# EAGLE schematic plug-v20-Make-board-myself-to-test-circuit (EAGLE 7.6.0)
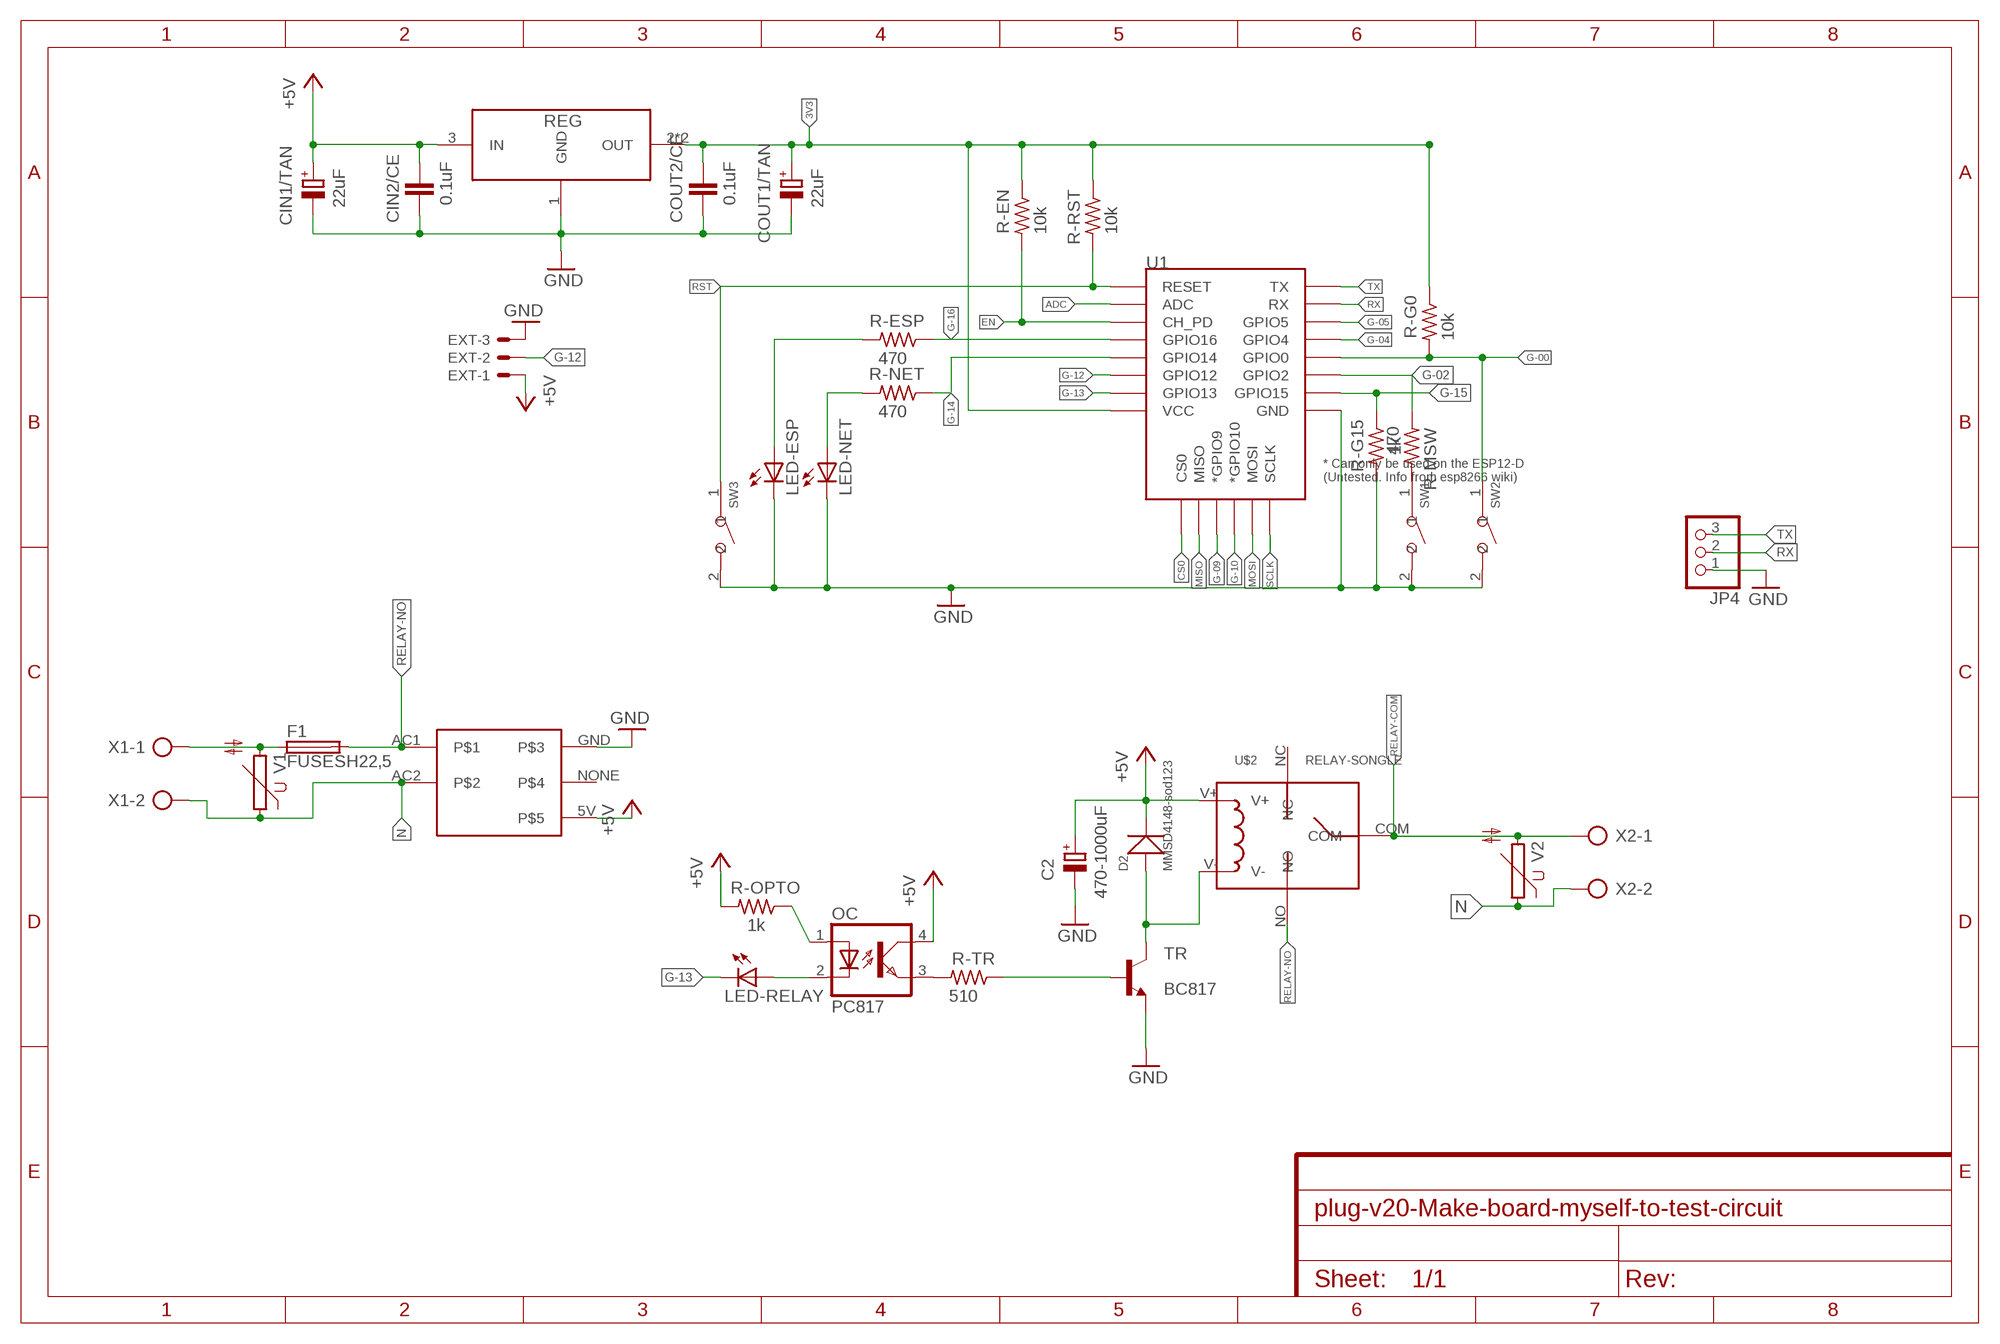
[diagram p0: schematic, sheet 1]

## Parts
C2  470-1000uF  CPOL-EUE3.5-8  [E3,5-8]
CIN1/TAN  22uF  CPOL-EUB/3528-21R  [B/3528-21R]
CIN2/CE  0.1uF  C-EUC0805K  [C0805K]
COUT1/TAN  22uF  CPOL-EUB/3528-21R  [B/3528-21R]
COUT2/CE  0.1uF  C-EUC0805K  [C0805K]
D2  MMSD4148-sod123  SMD-DIODE-100V-200MA(SOD-123)  [SOD-123]
EXT  53048-03  [53048-03]
F1  FUSESH22,5  [SH22,5]
JP4  PINHD-1X3  [1X03]
LED-ESP  LEDCHIPLED_0805  [CHIPLED_0805]
LED-NET  LEDCHIPLED_0805  [CHIPLED_0805]
LED-RELAY  LEDCHIPLED_0805  [CHIPLED_0805]
OC  PC817  [DIL04]
R-EN  10k  R-US_M0805  [M0805]
R-ESP  470  R-US_M0805  [M0805]
R-G0  10k  R-US_M0805  [M0805]
R-G15  1k  R-US_M0805  [M0805]
R-MSW  470  R-US_M0805  [M0805]
R-NET  470  R-US_M0805  [M0805]
R-OPTO  1k  R-US_M0805  [M0805]
R-RST  10k  R-US_M0805  [M0805]
R-TR  510  R-US_M0805  [M0805]
REG  AMS1117-3.3  [SOT-223]
SW1  DIP-BUTTON(2P-6.0X3.0X4.3MM)-TS-1101F  [SW2-5.0-6.0X3.0X4.3MM]
SW2  DIP-BUTTON(2P-6.0X3.0X4.3MM)-TS-1101F  [SW2-5.0-6.0X3.0X4.3MM]
SW3  DIP-BUTTON(2P-6.0X3.0X4.3MM)-TS-1101F  [SW2-5.0-6.0X3.0X4.3MM]
TR  BC817  BC817-16SMD  [SOT23-BEC]
U1  ESP12ESMD  [ESP12E-SMD]
U$2  RELAY-SONGLE  [RELAY-SONGLE]
U$4  POWERSUPPLY-5V-700MA  [POWERSUPPLY-5V-700MA]
V1  S14K11  [S14K11]
V2  S14K11  [S14K11]
X1  AK300/2  [AK300/2]
X2  AK300/2  [AK300/2]

## Nets
3V3: COUT1/TAN.+ COUT2/CE.1 R-EN.1 R-G0.1 R-RST.1 REG.2(OUT) REG.4(OUT) U1.VCC
+5V: C2.+ CIN1/TAN.+ CIN2/CE.1 D2.- EXT.1 OC.4(COL) R-OPTO.2 REG.3(IN) U$2.V+ U$4.5V
ADC: U1.ADC
CS0: U1.CS0
EN: R-EN.2 U1.CH_PD
G-00: R-G0.2 SW2.1 U1.GPIO0
G-02: R-MSW.2 U1.GPIO2
G-04: U1.GPIO4
G-05: U1.GPIO5
G-09: U1.GPIO9(*GPIO9)
G-10: U1.GPIO10(*GPIO10)
G-12: EXT.2 U1.GPIO12
G-13: LED-RELAY.C U1.GPIO13
G-14: R-NET.1 U1.GPIO14
G-15: R-G15.1 U1.GPIO15
G-16: R-ESP.1 U1.GPIO16
GND: C2.- CIN1/TAN.- CIN2/CE.2 COUT1/TAN.- COUT2/CE.2 EXT.3 JP4.1 LED-ESP.C LED-NET.C R-G15.2 REG.1(GND) SW1.2 SW2.2 SW3.2 TR.E U1.GND U$4.GND
LINE: F1.1 V1.2 X1.1
MISO: U1.MISO
MOSI: U1.MOSI
N: U$4.AC2 V1.1 V2.1 X1.2 X2.2
N$1: OC.3(EMIT) R-TR.2
N$2: R-TR.1 TR.B
N$6: LED-ESP.A R-ESP.2
N$13: OC.1(A) R-OPTO.1
N$16: LED-NET.A R-NET.2
N$17: D2.+ TR.C U$2.V-
N$21: LED-RELAY.A OC.2(C)
N$22: R-MSW.1 SW1.1
RELAY-COM: U$2.COM V2.2 X2.1
RELAY-NO: F1.2 U$2.NO U$4.AC1
RST: R-RST.2 SW3.1 U1.RESET
RX: JP4.2 U1.RXD0(RX)
SCLK: U1.SCLK
TX: JP4.3 U1.TXD0(TX)
Unconnected: U$2.NC U$4.NONE

## Library data of the parts
C2 CIN1/TAN COUT1/TAN = rcl:CPOL-EU: POLARIZED CAPACITOR, European symbol
CIN2/CE COUT2/CE = rcl:C-EU: CAPACITOR, European symbol
D2 = Seeed-OPL-Diode:SMD-DIODE-100V-200MA(SOD-123): 304010007; MPN: MMSD4148
EXT = con-molex:53?-03: CONNECTOR wire to board 1.25 mm (.049 inch) pitch header; MF: WALDOM/MOLEX; MPN: 53048-0310; OC_FARNELL: 9732918; OC_NEWARK: 38C9908
F1 = fuse:FUSE: Fuse; OC_FARNELL: unknown; OC_NEWARK: unknown
JP4 = pinhead:PINHD-1X3: PIN HEADER
LED-ESP LED-NET LED-RELAY = led:LED: LED OSRAM: - CHIPLED LG R971, LG N971, LY N971, LG Q971, LY Q971, LO R971, LY R971 LH N974, LH R974 LS Q976, LO Q976, LY Q976 LO Q996 - Hyper CHIPLED LW Q18S LB Q993, LB Q99A, LB R99A - SideLED LS A670, LO A670, LY A670, LG A670, LP A670 LB A673, LV A673, LT A673, LW A673 LH A674 LY A675 LS A676, LA A676, LO A676, LY A676, LW A676 LS A679, LY A679, LG A679 - Hyper Micro SIDELED® LS Y876, LA Y876, LO Y876, LY Y876 LT Y87S - SmartLED LW L88C, LW L88S LB L89C, LB L89S, LG L890 LS L89K, LO L89K, LY L89K LS L896, LA L896, LO L896, LY L896 - TOPLED LS T670, LO T670, LY T670, LG T670, LP T670 LSG T670, LSP T670, LSY T670, LOP T670, LYG T670 LG T671, LOG T671, LSG T671 LB T673, LV T673, LT T673, LW T673 LH T674 LS T676, LA T676, LO T676, LY T676, LB T676, LH T676, LSB T676, LW T676 LB T67C, LV T67C, LT T67C, LS T67K, LO T67K, LY T67K, LW E67C LS E67B, LA E67B, LO E67B, LY E67B, LB E67C, LV E67C, LT E67C LW T67C LS T679, LY T679, LG T679 LS T770, LO T770, LY T770, LG T770, LP T770 LB T773, LV T773, LT T773, LW T773 LH T774 LS E675, LA E675, LY E675, LS T675 LS T776, LA T776, LO T776, LY T776, LB T776 LHGB T686 LT T68C, LB T68C - Hyper Mini TOPLED® LB M676 - Mini TOPLED Santana® LG M470 LS M47K, LO M47K, LY M47K Source: http://www.osram.convergy.de LUXEON: - LUMILED® LXK2-PW12-R00, LXK2-PW12-S00, LXK2-PW14-U00, LXK2-PW14-V00 LXK2-PM12-R00, LXK2-PM12-S00, LXK2-PM14-U00 LXK2-PE12-Q00, LXK2-PE12-R00, LXK2-PE12-S00, LXK2-PE14-T00, LXK2-PE14-U00 LXK2-PB12-K00, LXK2-PB12-L00, LXK2-PB12-M00, LXK2-PB14-N00, LXK2-PB14-P00, LXK2-PB14-Q00 LXK2-PR12-L00, LXK2-PR12-M00, LXK2-PR14-Q00, LXK2-PR14-R00 LXK2-PD12-Q00, LXK2-PD12-R00, LXK2-PD12-S00 LXK2-PH12-R00, LXK2-PH12-S00 LXK2-PL12-P00, LXK2-PL12-Q00, LXK2-PL12-R00 Source: www.luxeon.com KINGBRIGHT: KA-3528ASYC Source: www.kingbright.com
OC = optocoupler:PC817: SHARP OPTO COUPLER; MPN: PC817X4J000F; OC_FARNELL: 9707727; OC_NEWARK: 97K7059
R-EN R-ESP R-G0 R-G15 R-MSW R-NET R-OPTO R-RST R-TR = rcl:R-US_: RESISTOR, American symbol
REG = AMS1117-3.3:AMS1117-3.3: 1A LOW DROPOUT VOLTAGE REGULATOR
SW1-SW3 = Seeed-OPL-Switch:DIP-BUTTON(2P-6.0X3.0X4.3MM): 311020025
TR = transistor-npn:BC817*: NPN Transistor
U1 = esp8266modules:ESP12E: ESP12E Module
U$2 = Relay-Songle:RELAY-SONGLE
U$4 = PowerSupply-5V-700mA:POWERSUPPLY-5V-700MA
V1 V2 = varistor:S14K11: VARISTOR
X1 X2 = con-ptr500:AK300/2: CONNECTOR; OC_FARNELL: unknown; OC_NEWARK: unknown